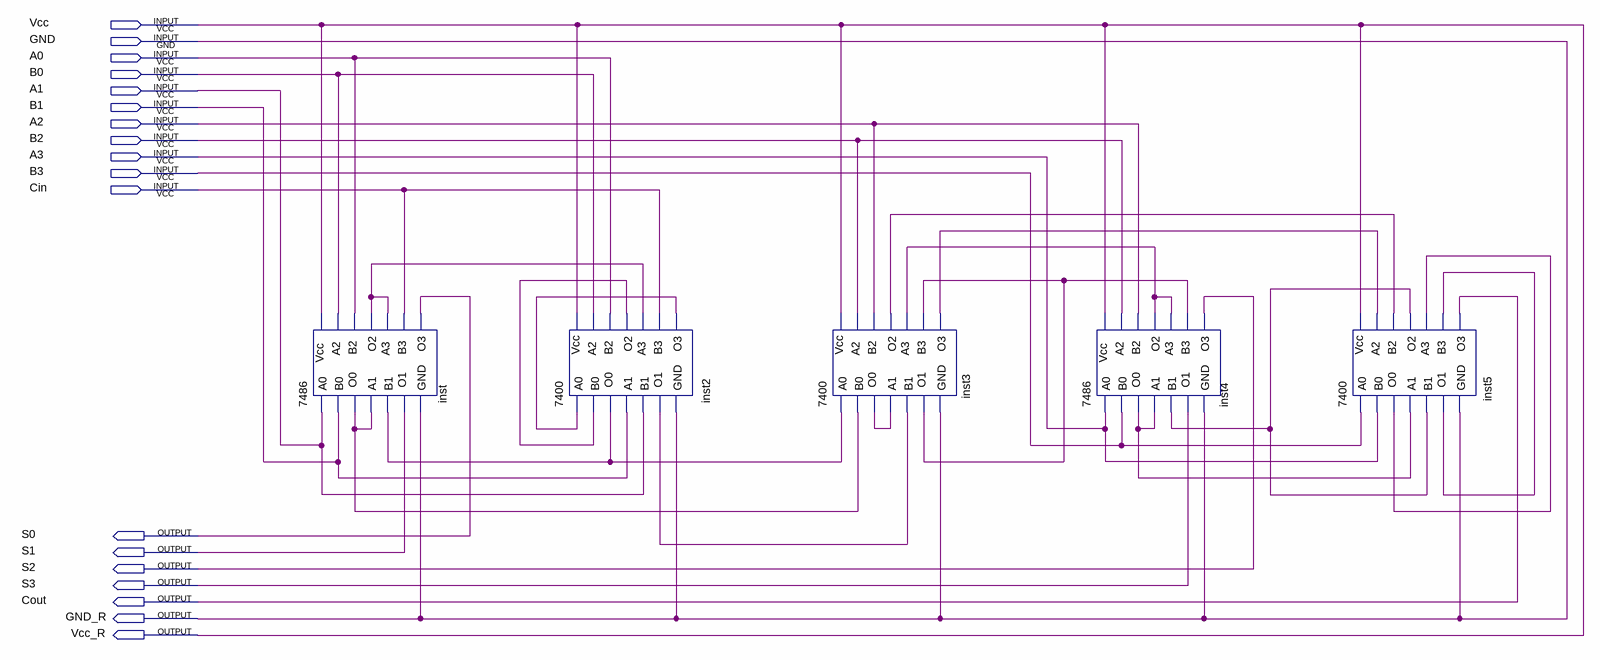
[diagram p0: schematic sheet]
// Quartus schematic Circuit_3.bdf as structural Verilog: 5 symbols, 18 pins
module Circuit_3 (
  input  Vcc,
  input  GND,
  input  A0,
  input  B0,
  input  A1,
  input  B1,
  input  A2,
  input  B2,
  input  A3,
  input  B3,
  input  Cin,
  output S0,
  output S1,
  output S2,
  output S3,
  output Cout,
  output GND_R,
  output Vcc_R
);

  wire inst2_o0, inst2_o1, inst2_o2, inst2_o3, inst3_o0, inst3_o1, inst3_o2, inst3_o3, inst4_o0, inst4_o2,
       inst5_o0, inst5_o1, inst5_o2, inst_o0, inst_o2;

  \7486  inst (
    .Vcc(Vcc), .A0(A1), .B0(B1), .A1(inst_o0), .B1(inst2_o0), .A2(B0), .B2(A0), .A3(inst_o2), .B3(Cin),
    .GND(GND), .O0(inst_o0), .O1(S1), .O2(inst_o2), .O3(S0));
  \7400  inst2 (
    .Vcc(Vcc), .A0(inst2_o3), .B0(inst2_o2), .A1(B1), .B1(A1), .A2(B0), .B2(A0), .A3(inst_o2), .B3(Cin),
    .GND(GND), .O0(inst2_o0), .O1(inst2_o1), .O2(inst2_o2), .O3(inst2_o3));
  \7400  inst3 (
    .Vcc(Vcc), .A0(inst2_o0), .B0(inst_o0), .A1(inst3_o0), .B1(inst2_o1), .A2(B2), .B2(A2), .A3(inst4_o2),
    .B3(inst3_o1), .GND(GND), .O0(inst3_o0), .O1(inst3_o1), .O2(inst3_o2), .O3(inst3_o3));
  \7486  inst4 (
    .Vcc(Vcc), .A0(A3), .B0(B3), .A1(inst4_o0), .B1(inst5_o2), .A2(B2), .B2(A2), .A3(inst4_o2),
    .B3(inst3_o1), .GND(GND), .O0(inst4_o0), .O1(S3), .O2(inst4_o2), .O3(S2));
  \7400  inst5 (
    .Vcc(Vcc), .A0(B3), .B0(A3), .A1(inst4_o0), .B1(inst5_o2), .A2(inst3_o3), .B2(inst3_o2), .A3(inst5_o0),
    .B3(inst5_o1), .GND(GND), .O0(inst5_o0), .O1(inst5_o1), .O2(inst5_o2), .O3(Cout));

  assign GND_R = GND;
  assign Vcc_R = Vcc;
endmodule
